# Altium project PiRA-RTC-HAT-PCB.PrjPcb (part 1 of 3)
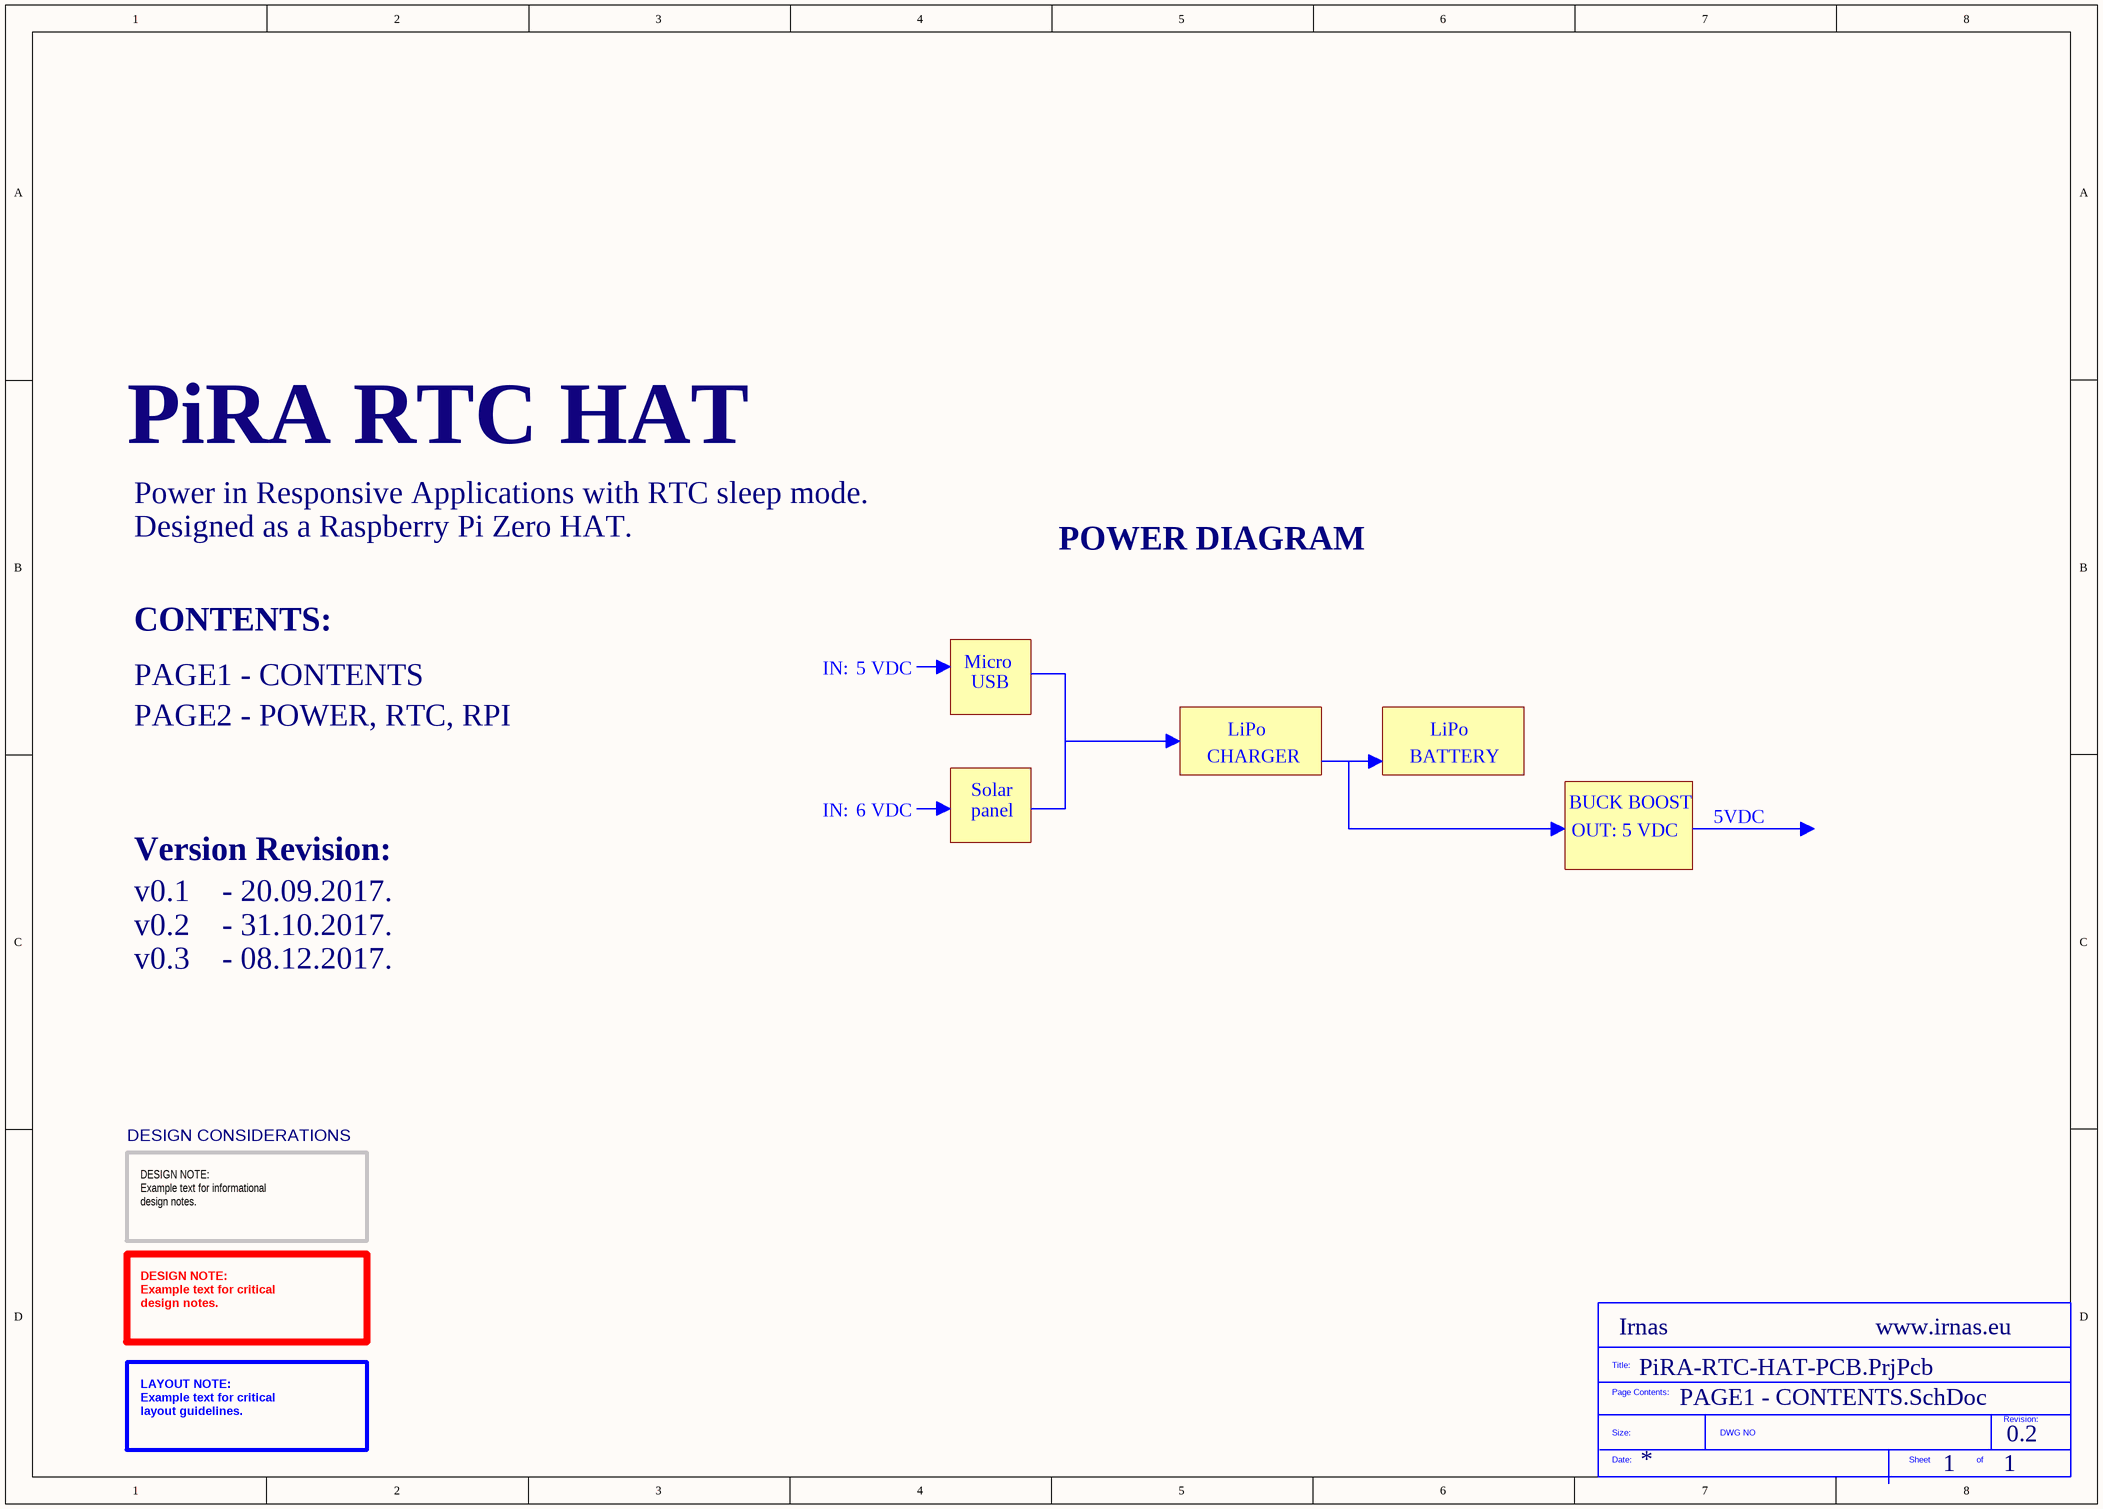
[diagram p0: PAGE1 - CONTENTS.SchDoc]
Company: Irnas; ProjectTitle: PiRA RTC HAT; Version: 0.2; Website: www.irnas.eu
2 sheets, 94 parts. Net scope: global (net labels, ports and power ports of the same name join across sheets).
Board file: PiRA-RTC-HAT-PCB.PcbDoc
Sheets:
  PAGE1 - CONTENTS.SchDoc
  PAGE2 - POWER, RTC, RPI.SchDoc

## Sheet PAGE1 - CONTENTS.SchDoc
size A3; DocumentNumber: 1; SheetNumber: 1; SheetTotal: 1

### Parts
(Parts that share a designator on the sheet are numbered #1, #2 ... from top to bottom, then left to right.)
*?#1  SDTitleBlock  (value not drawn)  (graphical)

### Notes on the sheet
- Power in Responsive Applications with RTC sleep mode.
- Designed as a Raspberry Pi Zero HAT.
- POWER DIAGRAM
- CONTENTS:
- PAGE1 - CONTENTS
- IN:
- 5 VDC
- Micro
- USB
- PAGE2 - POWER, RTC, RPI
- CHARGER
- LiPo
- BATTERY
- 6 VDC
- Solar
- panel
- BUCK BOOST
- OUT: 5 VDC
- 5VDC
- Version Revision:
- v0.1    - 20.09.2017.
- v0.2    - 31.10.2017.
- v0.3    - 08.12.2017.
- DESIGN CONSIDERATIONS
- DESIGN NOTE:
  Example text for informational
  design notes.
- DESIGN NOTE:
  Example text for critical
  design notes.
- LAYOUT NOTE:
  Example text for critical
  layout guidelines.
- (in symbol SDTitleBlock) Title:; Page Contents:; Revision:; Size:; DWG NO; Date:; Sheet; of

## Sheet PAGE2 - POWER, RTC, RPI.SchDoc
size A3; PageSetup: Record=PageOptions|CenterHorizontal=True|CenterVertical=True|PrintScale=0.71|XCorrection=1.00|YCorrection=1.00|PrintKind=1|BorderSize=5000000|LeftOffset=0|BottomOffset=0|Orientation=2|PaperLength=1000|PaperWidth=1000|Scale=100|PaperSource=282|PrintQuality=-3|MediaType=1|DitherType=10|PrintScaleMode=1|PaperKind=A4|PaperIndex=9
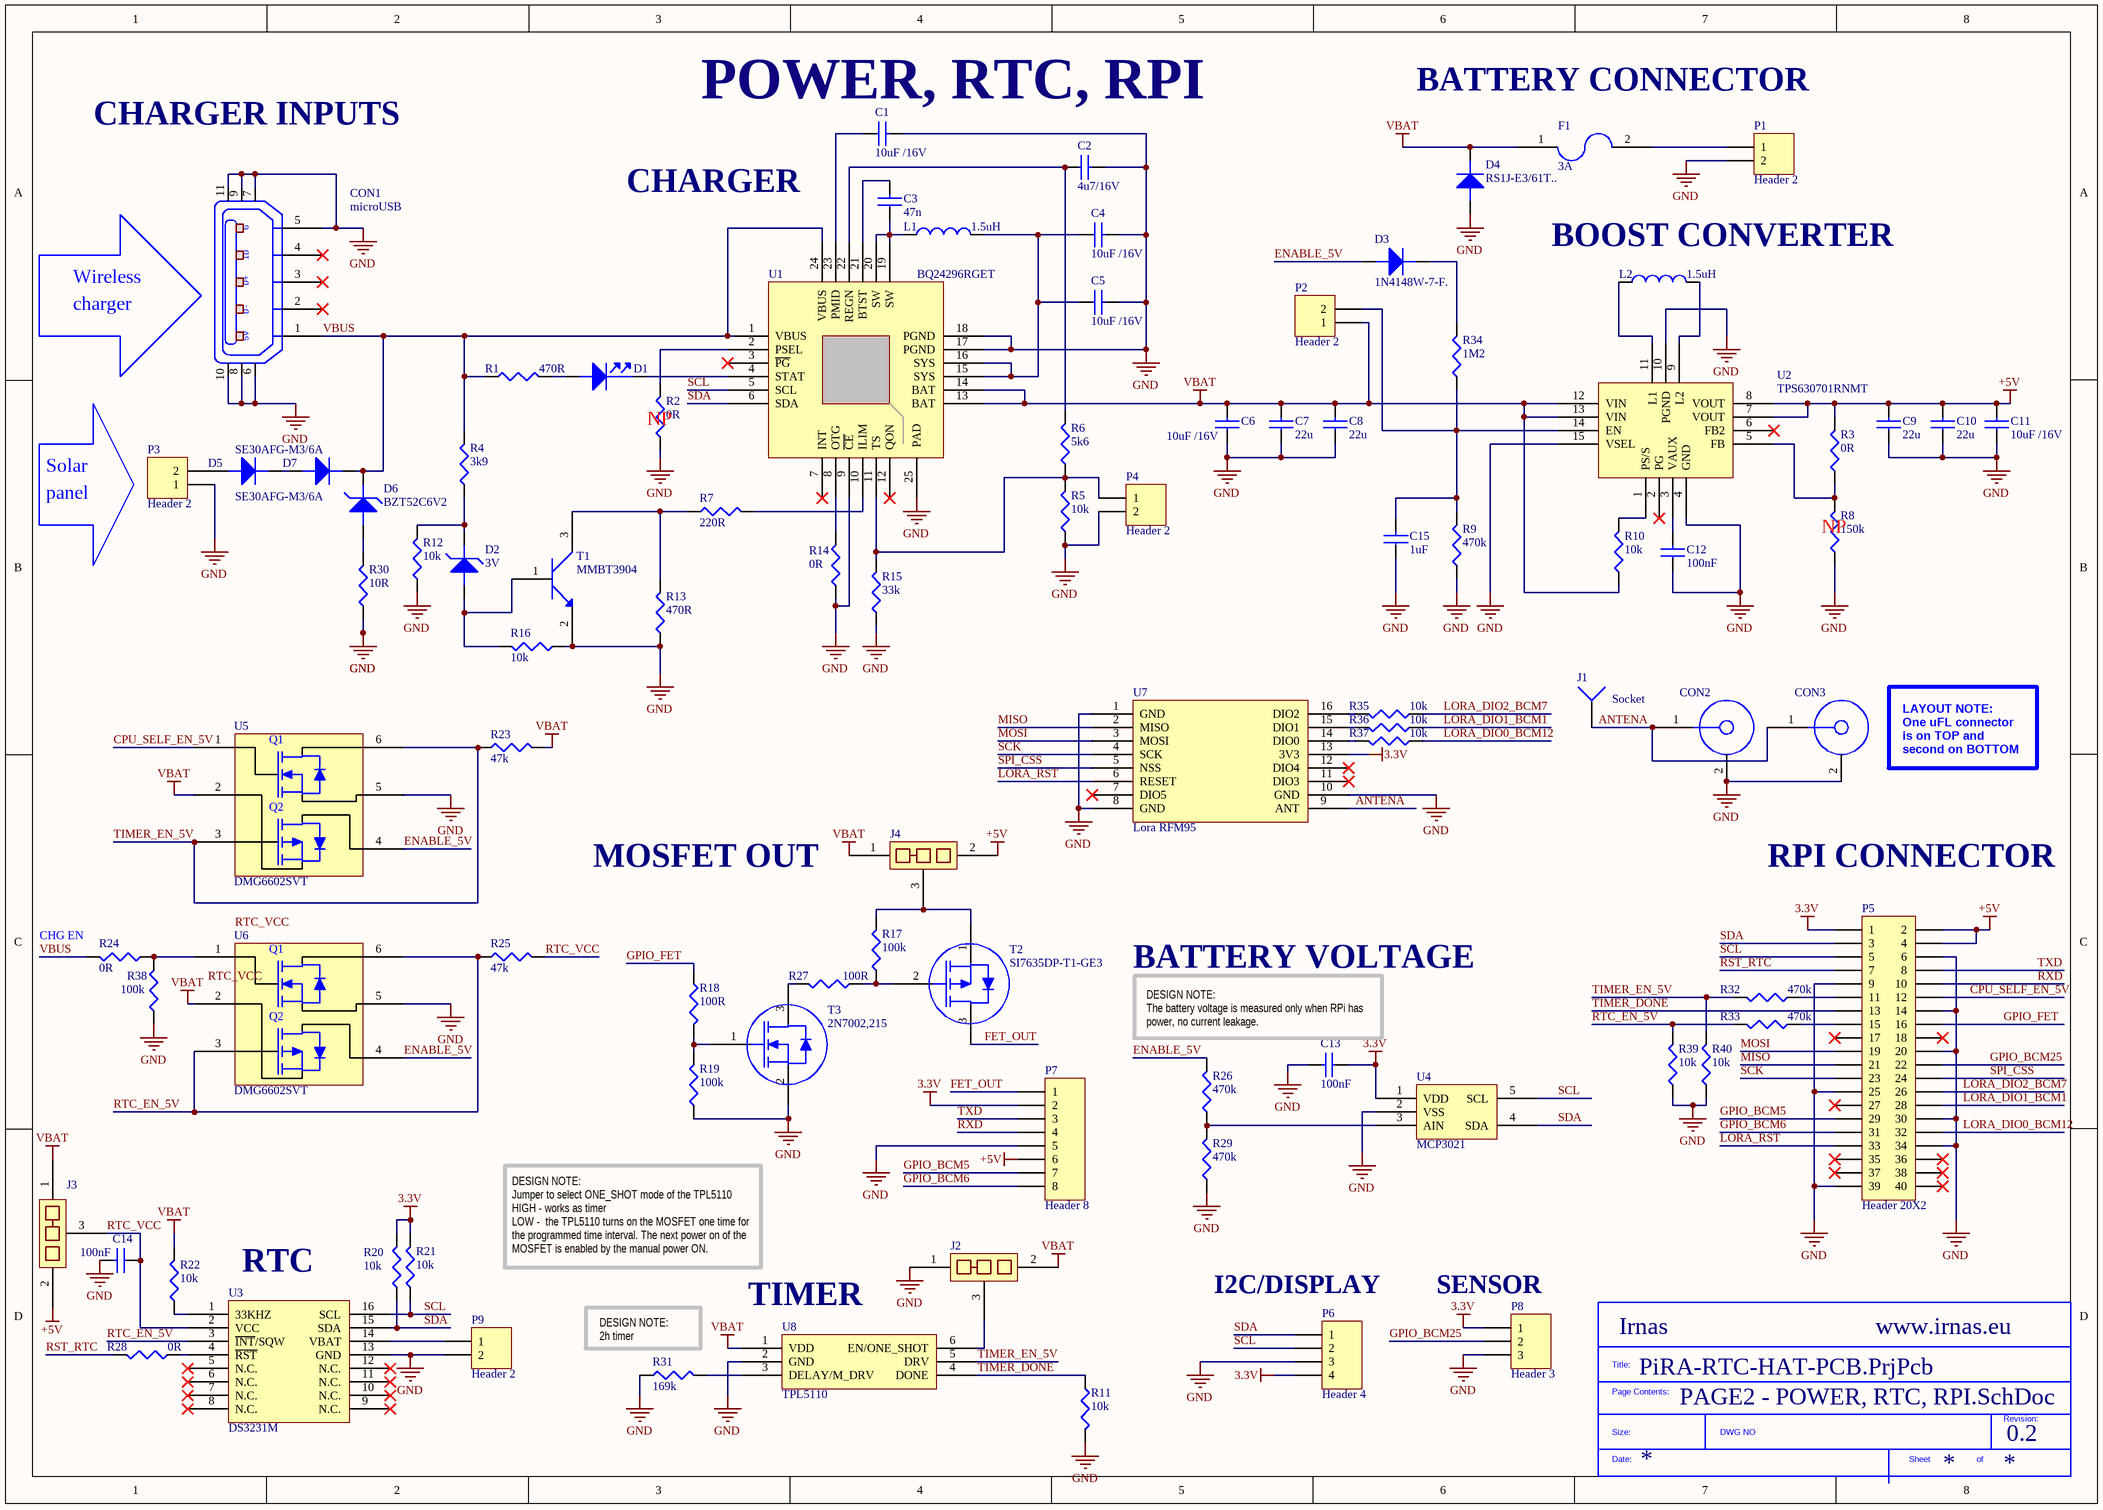
[diagram p1: PAGE2 - POWER, RTC, RPI.SchDoc]

### Parts
(Parts that share a designator on the sheet are numbered #1, #2 ... from top to bottom, then left to right.)
*?#2  SDTitleBlock  (value not drawn)  (graphical)
C1  10uF /16V  [CAP0805]
C2  4u7/16V  [CAP0603]
C3  47n  [CAP0603]
C4  10uF /16V  [CAP0805]
C5  10uF /16V  [CAP0805]
C6  10uF /16V  [CAP0805]
C7  22u  [CAP0805]
C8  22u  [CAP0805]
C9  22u  [CAP0805]
C10  22u  [CAP0805]
C11  10uF /16V  [CAP0805]
C12  100nF  [CAP0603]
C13  100nF  [CAP0603]
C14  100nF  [CAP0603]
C15  1uF  [CAP0603]
CON1  microUSB  [microUSB-CHINA]  (no BOM)
CON2  U.FL-R-SMT-1(10)  [uFL SMD connector]  (value not drawn)
CON3  U.FL-R-SMT-1(10)  [uFL SMD connector]  (value not drawn)
D1  LED RED  [LED0603]  (value not drawn)
D2  3V  [SOD-323 2L]
D3  1N4148W-7-F.  [SOD123]
D4  RS1J-E3/61T..  [SMC/DO-214AC]
D5  SE30AFG-M3/6A  [SODFL127P600-8N]
D6  BZT52C6V2  [SOD123]
D7  SE30AFG-M3/6A  [SODFL127P600-8N]
F1  3A  [Chip2PinSM127P600-8N]
J1  Socket  [PIN1]  (no BOM)
J2  solder_jumper  [Solder Jumper Normal Close]  (value not drawn)  (no BOM)
J3  solder_jumper  [Solder Jumper Normal Close]  (value not drawn)  (no BOM)
J4  solder_jumper  [Solder Jumper Normal Close]  (value not drawn)  (no BOM)
L1  1.5uH  [FDSD0402]
L2  1.5uH  [FDSD0402]
P1  Header 2  [HDR1X2]  (no BOM)
P2  Header 2  [HDR1X2]  (no BOM)
P3  Header 2  [HDR1X2]  (no BOM)
P4  Header 2  [HDR1X2]  (no BOM)
P5  Header 20X2  [HDR2X20]  (no BOM)
P6  Header 4  [HDR1X4]  (no BOM)
P7  Header 8  [HDR1X8]  (no BOM)
P8  Header 3  [HDR1X3]  (no BOM)
P9  Header 2  [HDR1X2]  (no BOM)
R1  470R  [RES0603]
R2  0R  [RES0603]
R3  0R  [RES0603]
R4  3k9  [RES0603]
R5  10k  [RES0603]
R6  5k6  [RES0603]
R7  220R  [RES0603]
R8  150k  [RES0603]
R9  470k  [RES0603]
R10  10k  [RES0603]
R11  10k  [RES0603]
R12  10k  [RES0603]
R13  470R  [RES0603]
R14  0R  [RES0603]
R15  33k  [RES0603]
R16  10k  [RES0603]
R17  100k  [RES0603]
R18  100R  [RES0603]
R19  100k  [RES0603]
R20  10k  [RES0603]
R21  10k  [RES0603]
R22  10k  [RES0603]
R23  47k  [RES0603]
R24  0R  [RES0603]
R25  47k  [RES0603]
R26  470k  [RES0603]
R27  100R  [RES0603]
R28  0R  [RES0603]
R29  470k  [RES0603]
R30  10R  [RES0603]
R31  169k  [RES0603]
R32  470k  [RES0603]
R33  470k  [RES0603]
R34  1M2  [RES0603]
R35  10k  [RES0603]
R36  10k  [RES0603]
R37  10k  [RES0603]
R38  100k  [RES0603]
R39  10k  [RES0603]
R40  10k  [RES0603]
T1  MMBT3904  [SOT23127P600-8N]
T2  SI7635DP-T1-GE3  [PG-TSDSON-8]
T3  2N7002,215  [SOT23127P600-8N]
U1  BQ24296RGET  [QFN4x4]
U2  TPS630701RNMT  [VQFN TPS]
U3  DS3231M  [SOIC127P1030X265-16N]
U4  MCP3021  [SOT23127P600-8N - duplicate]
U5  DMG6602SVT  [TSOT26]
U6  DMG6602SVT  [TSOT26]
U7  Lora RFM95  [Lora_module1]
U8  TPL5110  [SOT236]

### Nets
3.3V: C13.1 P5.1 P6.4 P7.2 P8.1 R20.2 R21.2 U4.1(VDD) U7.13(3V3)
+5V: C9.2 C10.2 C11.2 J3.2 J4.2 P5.2 P5.4 P7.6 R3.2 U2.7(VOUT) U2.8(VOUT)
GND: C1.2 C2.2 C4.2 C5.2 C6.1 C7.1 C8.1 C9.1 C10.1 C11.1 C12.1 C13.2 C14.2 C15.1 CON1.5(P5) CON1.6 CON1.7 CON1.8 CON1.9 CON1.10 CON1.11 CON2.2 CON3.2 D4.2(ANODE) J2.1 P1.2 P3.1 P4.2 P5.6 P5.9 P5.14 P5.20 P5.25 P5.30 P5.34 P5.39 P6.3 P7.5 P8.3 P9.2 R2.1 R5.1 R8.1 R9.1 R11.2 R12.1 R13.1 R14.1 R15.1 R16.1 R19.1 R29.1 R30.1 R31.1 R38.1 R39.1 R40.1 T1.2 T3.2 U1.9(~{CE}) U1.17(PGND) U1.18(PGND) U1.25(PAD) U2.4(GND) U2.10(PGND) U2.15(VSEL) U3.13(GND) U4.2(VSS) U5.5(S1) U6.5(S1) U7.1(GND) U7.8(GND) U7.10(GND) U8.2(GND)
VBAT: C6.2 C7.2 C8.2 D4.1(cathode) F1.1 J2.2 J3.1 J4.1 P2.1 R10.1 R22.2 R23.2 U1.13(BAT) U1.14(BAT) U2.12(VIN) U2.13(VIN) U5.2(S2) U6.2(S2) U8.1(VDD)
ANTENA: CON2.1 CON3.1 J1.1 U7.9(ANT)
CPU_SELF_EN_5V: P5.12 U5.1(G1)
ENABLE_5V: D3.2(ANODE) R26.2 U5.4(D2) U6.4(D2)
FET_OUT: P7.1 T2.3
GPIO_BCM5: P5.29 P7.7
GPIO_BCM6: P5.31 P7.8
GPIO_BCM25: P5.22 P8.2
GPIO_FET: P5.16 R18.1
LORA_DIO0_BCM12: P5.32 R37.1
LORA_DIO1_BCM1: P5.28 R36.1
LORA_DIO2_BCM7: P5.26 R35.1
LORA_RST: P5.33 U7.6(RESET)
MISO: P5.21 U7.2(MISO)
MOSI: P5.19 U7.3(MOSI)
RST_RTC: P5.7 R28.2
RTC_EN_5V: R25.1 R33.2 R39.2 U3.3(~{INT}/SQW) U6.3(G2) U6.6(D1)
RTC_VCC: C14.1 J3.3 R25.2 U3.2(VCC)
RXD: P5.10 P7.4
SCK: P5.23 U7.4(SCK)
SCL: P5.5 P6.2 R21.1 U1.5(SCL) U3.16(SCL) U4.5(SCL)
SDA: P5.3 P6.1 R20.1 U1.6(SDA) U3.15(SDA) U4.4(SDA)
SPI_CSS: P5.24 U7.5(NSS)
TIMER_DONE: P5.13 R11.1 U8.4(DONE)
TIMER_EN_5V: R23.1 R32.2 R40.2 U5.3(G2) U5.6(D1) U8.5(DRV)
TXD: P5.8 P7.3
VBUS: CON1.1(P1) D6.1(cathode) D7.1(cathode) R1.1 R4.2 R24.2 U1.1(VBUS) U1.24(VBUS)
NetC1_1: C1.1 U1.23(PMID)
NetC2_1: C2.1 R6.2 U1.22(REGN)
NetC3_1: C3.1 L1.1 U1.19(SW) U1.20(SW)
NetC3_2: C3.2 U1.21(BTST)
NetC4_1: C4.1 C5.1 L1.2 U1.15(SYS) U1.16(SYS)
NetC12_2: C12.2 U2.3(VAUX)
NetC15_2: C15.2 P2.2 R9.2 R34.1 U2.14(EN)
NetD1_1: D1.1(cathode) U1.4(STAT)
NetD1_2: D1.2(ANODE) R1.2
NetD2_1: D2.1(cathode) R4.1 R12.2
NetD2_2: D2.2(ANODE) R16.2 T1.1
NetD3_1: D3.1(cathode) R34.2
NetD5_1: D5.1(cathode) D7.2(ANODE)
NetD5_2: D5.2(ANODE) P3.2
NetD6_2: D6.2(ANODE) R30.2
NetF1_2: F1.2 P1.1
NetJ2_3: J2.3 U8.6(EN/ONE_SHOT)
NetJ4_3: J4.3 R17.2 T2.1
NetL2_1: L2.1 U2.11(L1)
NetL2_2: L2.2 U2.9(L2)
NetP4_1: P4.1 R5.2 R6.1 R15.2 U1.11(TS)
NetP5_11: P5.11 R32.1
NetP5_15: P5.15 R33.1
NetP9_1: P9.1 U3.14(VBAT)
NetR2_2: R2.2 U1.2(PSEL)
NetR3_1: R3.1 R8.2 U2.5(FB)
NetR7_1: R7.1 R13.2 T1.3
NetR7_2: R7.2 U1.10(ILIM)
NetR10_2: R10.2 U2.1(PS/S)
NetR14_2: R14.2 U1.8(OTG)
NetR17_1: R17.1 R27.1 T2.2
NetR18_2: R18.2 R19.2 T3.1
NetR22_1: R22.1 U3.1(33KHZ)
NetR24_1: R24.1 R38.2 U6.1(G1)
NetR26_1: R26.1 R29.2 U4.3(AIN)
NetR27_2: R27.2 T3.3
NetR28_1: R28.1 U3.4(~{RST})
NetR31_2: R31.2 U8.3(DELAY/M_DRV)
NetR35_2: R35.2 U7.16(DIO2)
NetR36_2: R36.2 U7.15(DIO1)
NetR37_2: R37.2 U7.14(DIO0)

Not connected (* = marked no-connect by the designer): CON1 2(P2)* 3(P3)* 4(P4)*; P5 17* 18* 27* 35* 36* 37* 38* 40*; U1 3(~{PG})* 7(INT)* 12(QON)*; U2 2(PG)* 6(FB2)*; U3 5(N.C.)* 6(N.C.)* 7(N.C.)* 8(N.C.)* 9(N.C.)* 10(N.C.)* 11(N.C.)* 12(N.C.)*; U7 7(DIO5)* 11(DIO3)* 12(DIO4)*

### Notes on the sheet
- (near C1) POWER, RTC, RPI
- BATTERY CONNECTOR
- CHARGER INPUTS
- CHARGER
- Wireless
- charger
- (near L2) BOOST CONVERTER
- (near R2) NP
- Solar
- panel
- (near R8) NP
- LAYOUT NOTE:
  One uFL connector is on TOP and second on BOTTOM
- MOSFET OUT
- RPI CONNECTOR
- (near R24) CHG EN
- BATTERY VOLTAGE
- DESIGN NOTE:
  The battery voltage is measured only when RPi has power, no current leakage.
- (near U3) RTC
- DESIGN NOTE:
  Jumper to select ONE_SHOT mode of the TPL5110
  HIGH - works as timer
  LOW -  the TPL5110 turns on the MOSFET one time for the programmed time interval. The next power on of the MOSFET is enabled by the manual power ON.
- (near U8) TIMER
- (near P6) I2C/DISPLAY
- (near P8) SENSOR
- (near R31) DESIGN NOTE:
  2h timer
- Labels drawn without touching a wire or pin: RTC_VCC
- (in symbol DMG6602SVT) Q1; Q2
- (in symbol Micro USB CHINA 1) G; ID; D+; D-; 5V
- (in symbol SDTitleBlock) Title:; Page Contents:; Revision:; Size:; DWG NO; Date:; Sheet; of